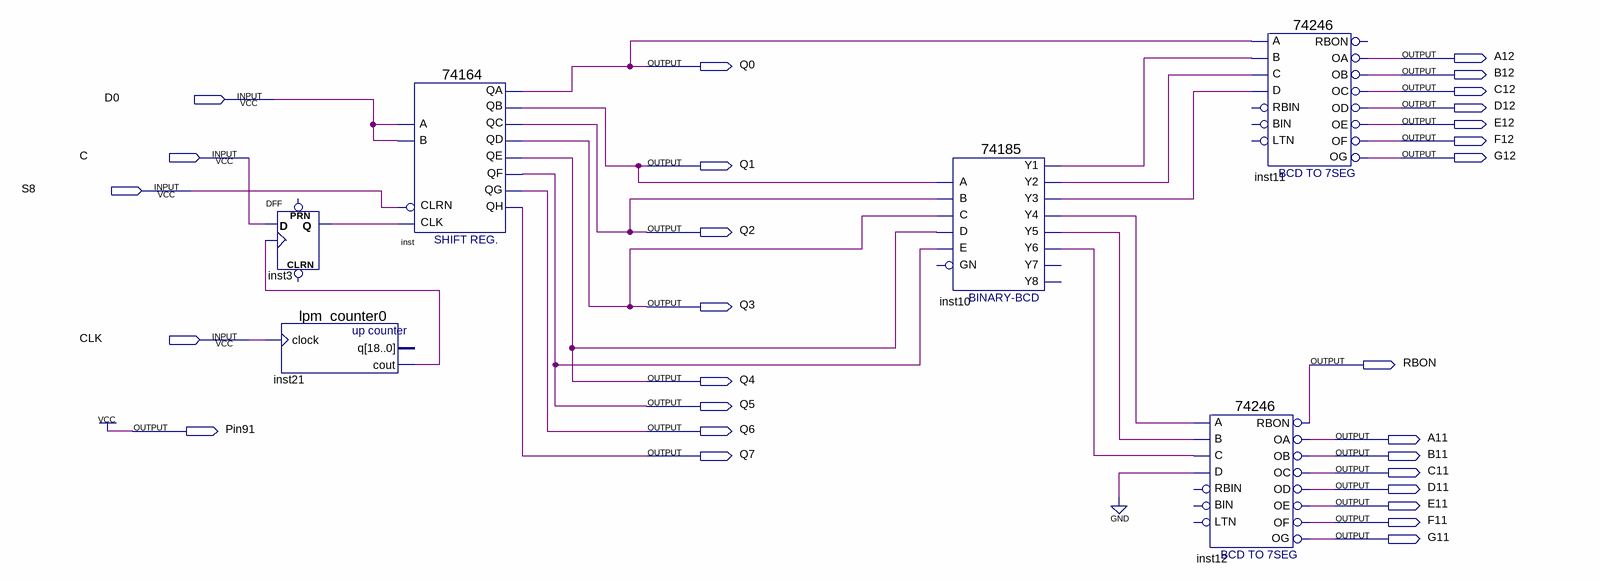
[diagram p0: schematic sheet]
// Quartus schematic Registers_2.bdf as structural Verilog: 6 symbols, 28 pins
module Registers_2 (
  input  D0,
  input  C,
  input  S8,
  input  CLK,
  output A12,
  output Q0,
  output B12,
  output C12,
  output D12,
  output E12,
  output F12,
  output G12,
  output Q1,
  output Q2,
  output Q3,
  output RBON,
  output Q4,
  output Q5,
  output Pin91,
  output Q6,
  output A11,
  output Q7,
  output B11,
  output C11,
  output D11,
  output E11,
  output F11,
  output G11
);

  wire inst3_q, inst10_y1, inst10_y2, inst10_y3, inst10_y4, inst10_y5, inst10_y6, inst21_cout;

  DFF inst3 (.CLK(inst21_cout), .D(C), .Q(inst3_q));  // open: CLRN, PRN
  lpm_counter0 inst21 (.clock(CLK), .cout(inst21_cout));  // open: q
  \74164  inst (
    .CLRN(S8), .CLK(inst3_q), .B(D0), .A(D0), .QD(Q3), .QC(Q2), .QA(Q0), .QF(Q5), .QH(Q7), .QG(Q6), .QE(Q4),
    .QB(Q1));
  \74185  inst10 (
    .A(Q1), .B(Q2), .D(Q4), .C(Q3), .E(Q5), .Y1(inst10_y1), .Y3(inst10_y3), .Y2(inst10_y2), .Y5(inst10_y5),
    .Y4(inst10_y4), .Y6(inst10_y6));  // open: GN, Y8, Y7
  \74246  inst12 (
    .B(inst10_y5), .A(inst10_y4), .D(1'b0), .C(inst10_y6), .OD(D11), .RBON(RBON), .OC(C11), .OB(B11),
    .OE(E11), .OF(F11), .OA(A11), .OG(G11));  // open: RBIN, LTN, BIN
  \74246  inst11 (
    .B(inst10_y1), .A(Q0), .D(inst10_y3), .C(inst10_y2), .OD(D12), .OC(C12), .OB(B12), .OE(E12), .OF(F12),
    .OA(A12), .OG(G12));  // open: RBIN, LTN, BIN, RBON

  assign Pin91 = 1'b1;
endmodule
